# EAGLE design driver (EAGLE 9.5.0)
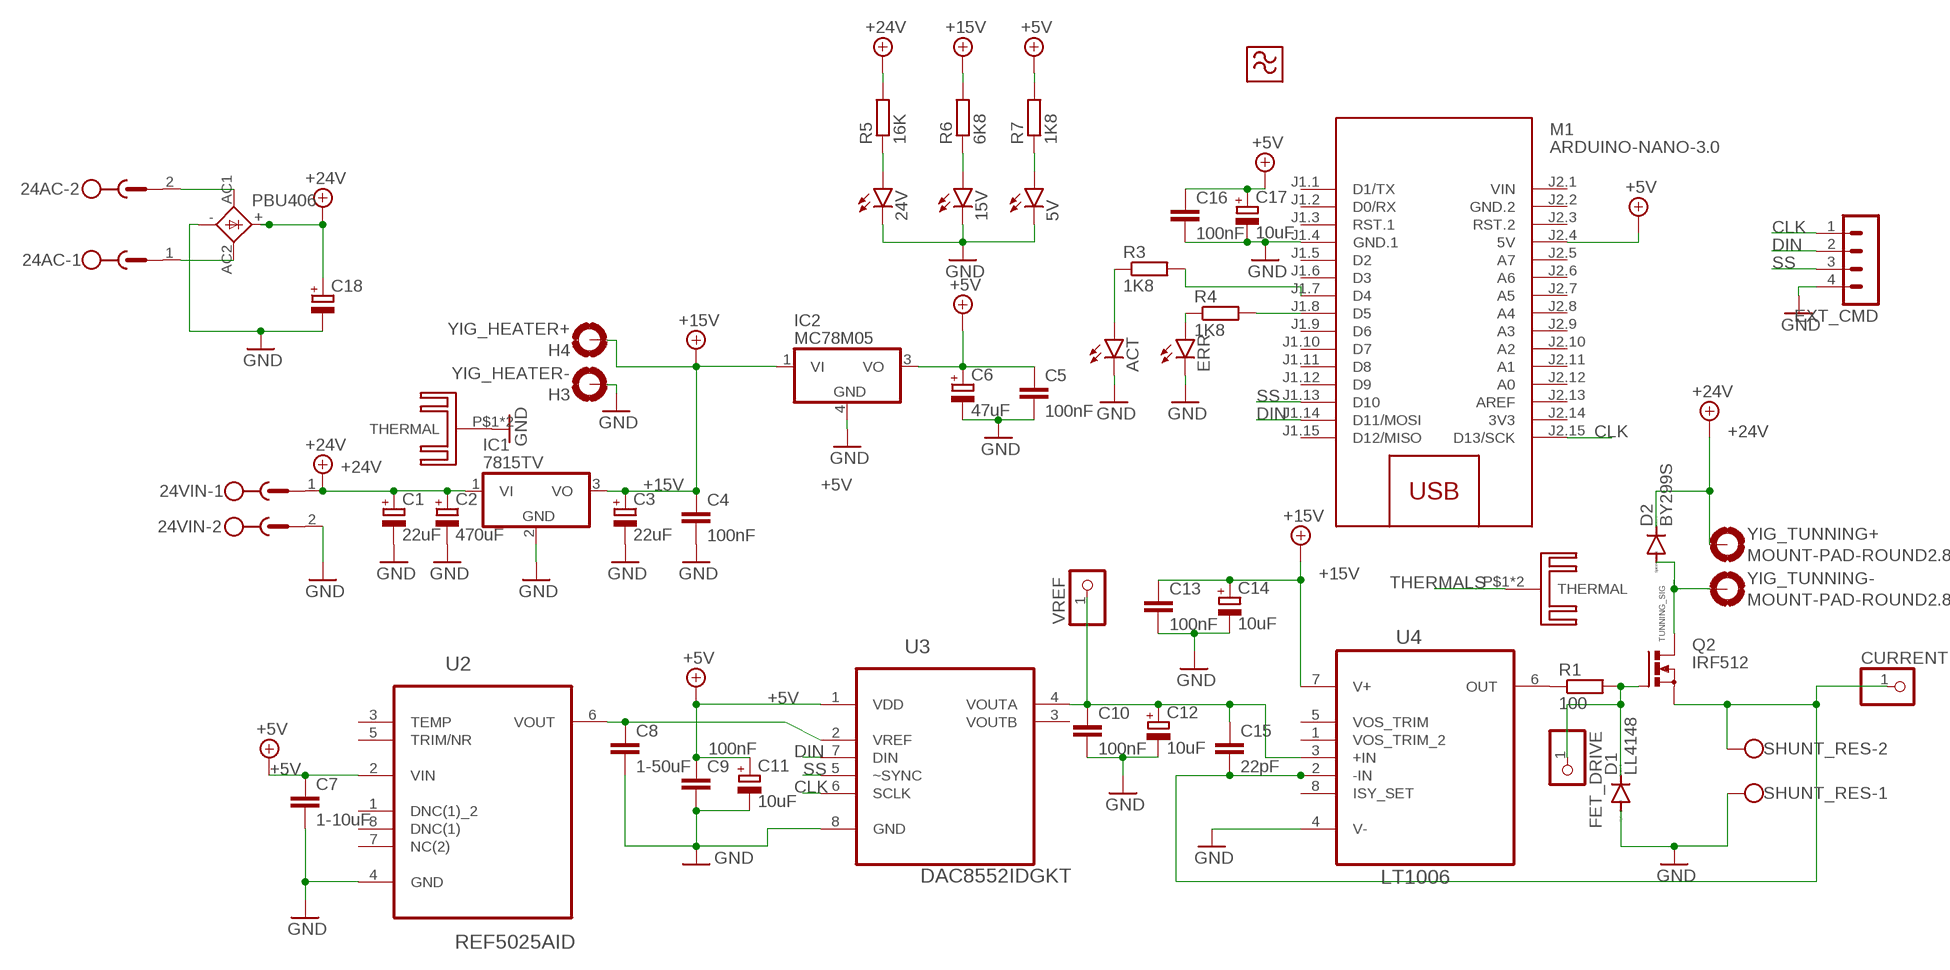
[diagram p0: schematic, sheet 1]

## Parts
5V  LEDCHIP-LED0805  [CHIP-LED0805]
15V  LEDCHIP-LED0805  [CHIP-LED0805]
24AC  MSTBV2  [MSTBV2]
24V  LEDCHIP-LED0805  [CHIP-LED0805]
24VIN  MSTBV2  [MSTBV2]
ACT  LEDCHIP-LED0805  [CHIP-LED0805]
C1  22uF  CPOL-EUE  [PANASONIC_E]
C2  470uF  CPOL-EUE5-10.5  [E5-10,5]
C3  22uF  CPOL-EUE  [PANASONIC_E]
C4  100nF  C-EUC1210  [C1210]
C5  100nF  C-EUC0603K  [C0603K]
C6  47uF  CPOL-EUD  [PANASONIC_D]
C7  1-10uF  C-EUC3216  [C3216]
C8  1-50uF  C-EUC3216  [C3216]
C9  100nF  C-EUC0603K  [C0603K]
C10  100nF  C-EUC0603K  [C0603K]
C11  10uF  CPOL-EUA/3216-18R  [A/3216-18R]
C12  10uF  CPOL-EUA/3216-18R  [A/3216-18R]
C13  100nF  C-EUC1210  [C1210]
C14  10uF  CPOL-EUE2.5-5  [E2,5-5]
C15  22pF  C-EUC0603  [C0603]
C16  100nF  C-EUC0603K  [C0603K]
C17  10uF  CPOL-EUA/3216-18R  [A/3216-18R]
C18  CPOL-EUE7.5-18  [E7,5-18]
CURRENT  PINHD-1X1  [1X01]
D1  LL4148  DIODE-SOD80C  [SOD80C]
D2  BY299S  DIODE-D-10  [D-10]
ERR  LEDCHIP-LED0805  [CHIP-LED0805]
EXT_CMD  MA04-1  [MA04-1]
FET_DRIVE  PINHD-1X1  [1X01]
H3  YIG_HEATER-  MOUNT-PAD-ROUND2.8  [2,8-PAD]
H4  YIG_HEATER+  MOUNT-PAD-ROUND2.8  [2,8-PAD]
HEATSYNK  SK09/20V  [SK09/20V]
IC1  7815TV  [TO220V]
IC2  MC78M05  MC78M05CDTG  [DPACK_3]
M1  ARDUINO-NANO-3.0  [ARDUINO-NANO-3.0]
PBU406  2KBP2KBP_MINE  [2KBP_MINE]
Q2  IRF512  [TO220BV]
R1  100  R-EU_M0805  [M0805]
R3  1K8  R-EU_M0805  [M0805]
R4  1K8  R-EU_M0805  [M0805]
R5  16K  R-EU_M0805  [M0805]
R6  6K8  R-EU_M0805  [M0805]
R7  1K8  R-EU_M0805  [M0805]
SHUNT_RES  W237-102  [W237-102]
U2  REF5025AID  [SOIC127P600X175-8N]
U3  DAC8552IDGKT  [SOP65P490X110-8N]
U4  LT1006  LT1006S8PBF  [SOIC127P600X175-8N]
U$1  SK09/20V  [SK09/20V]
U$2  YIG_FILTER  [EBAY]
VREF  PINHD-1X1  [1X01]
YIG_TUNNING+  MOUNT-PAD-ROUND2.8  [2,8-PAD]
YIG_TUNNING-  MOUNT-PAD-ROUND2.8  [2,8-PAD]

## Nets
+5V: C5.1 C6.+ C7.1 C9.1 C11.+ C16.1 C17.+ IC2.3(VO) M1.J2.4(5V) R7.2 U2.2(VIN) U3.1(VDD)
+15V: C3.+ C4.1 C13.1 C14.+ H4.B2,8(MOUNT) IC1.3(VO) IC2.1(VI) R6.2 U4.7(V+)
+24V: 24VIN.1 C1.+ C2.+ C18.+ D2.C IC1.1(VI) PBU406.+ R5.2 YIG_TUNNING+.B2,8(MOUNT)
CLK: EXT_CMD.1 M1.J2.15(D13/SCK) U3.6(SCLK)
DIN: EXT_CMD.2 M1.J1.14(D11/MOSI) U3.7(DIN)
GND: 5V.C 15V.C 24V.C 24VIN.2 ACT.C C1.- C2.- C3.- C4.2 C5.2 C6.- C7.2 C8.2 C9.2 C10.2 C11.- C12.- C13.2 C14.- C16.2 C17.- C18.- D1.A ERR.C EXT_CMD.4 H3.B2,8(MOUNT) HEATSYNK.P$1(THERMAL) HEATSYNK.P$2(THERMAL) IC1.2(GND) IC2.4(GND) M1.J1.4(GND.1) PBU406.- SHUNT_RES.1 U2.4(GND) U3.8(GND) U4.4(V-)
N$1: C8.1 U2.6(VOUT) U3.2(VREF)
N$2: 24V.A R5.1
N$3: C10.1 C12.+ C15.1 U3.4(VOUTA) U4.3(+IN) VREF.1
N$4: 24AC.2 PBU406.AC1
N$5: R1.1 U4.6(OUT)
N$6: D1.C FET_DRIVE.1 Q2.G R1.2
N$7: C15.2 CURRENT.1 Q2.S SHUNT_RES.2 U4.2(-IN)
N$8: 15V.A R6.1
N$9: 5V.A R7.1
N$10: M1.J1.7(D4) R3.2
N$11: M1.J1.8(D5) R4.2
N$12: ERR.A R4.1
N$13: ACT.A R3.1
N$17: 24AC.1 PBU406.AC2
SS: EXT_CMD.3 M1.J1.13(D10) U3.5(~SYNC)
THERMALS: U$1.P$1(THERMAL) U$1.P$2(THERMAL)
TUNNING_SIG: D2.A Q2.D YIG_TUNNING-.B2,8(MOUNT)
Unconnected: M1.J1.1(D1/TX) M1.J1.2(D0/RX) M1.J1.3(RST.1) M1.J1.5(D2) M1.J1.6(D3) M1.J1.9(D6) M1.J1.10(D7) M1.J1.11(D8) M1.J1.12(D9) M1.J1.15(D12/MISO) M1.J2.3(RST.2) M1.J2.5(A7) M1.J2.6(A6) M1.J2.7(A5) M1.J2.8(A4) M1.J2.9(A3) M1.J2.10(A2) M1.J2.11(A1) M1.J2.12(A0) M1.J2.13(AREF) U2.1(DNC(1)_2) U2.3(TEMP) U2.5(TRIM/NR) U2.7(NC(2)) U2.8(DNC(1)) U3.3(VOUTB) U4.1(VOS_TRIM_2) U4.5(VOS_TRIM) U4.8(ISY_SET)

## Power pins joined to a net without a drawn wire
3V3: M1.J2.14(3V3)
GND.2: M1.J2.2(GND.2)
VIN: M1.J2.1(VIN)

## Library data of the parts
5V 15V 24V ACT ERR = led:LED: LED OSRAM: - CHIPLED LG R971, LG N971, LY N971, LG Q971, LY Q971, LO R971, LY R971 LH N974, LH R974 LS Q976, LO Q976, LY Q976 LO Q996 - Hyper CHIPLED LW Q18S LB Q993, LB Q99A, LB R99A - SideLED LS A670, LO A670, LY A670, LG A670, LP A670 LB A673, LV A673, LT A673, LW A673 LH A674 LY A675 LS A676, LA A676, LO A676, LY A676, LW A676 LS A679, LY A679, LG A679 - Hyper Micro SIDELED® LS Y876, LA Y876, LO Y876, LY Y876 LT Y87S - SmartLED LW L88C, LW L88S LB L89C, LB L89S, LG L890 LS L89K, LO L89K, LY L89K LS L896, LA L896, LO L896, LY L896 - TOPLED LS T670, LO T670, LY T670, LG T670, LP T670 LSG T670, LSP T670, LSY T670, LOP T670, LYG T670 LG T671, LOG T671, LSG T671 LB T673, LV T673, LT T673, LW T673 LH T674 LS T676, LA T676, LO T676, LY T676, LB T676, LH T676, LSB T676, LW T676 LB T67C, LV T67C, LT T67C, LS T67K, LO T67K, LY T67K, LW E67C LS E67B, LA E67B, LO E67B, LY E67B, LB E67C, LV E67C, LT E67C LW T67C LS T679, LY T679, LG T679 LS T770, LO T770, LY T770, LG T770, LP T770 LB T773, LV T773, LT T773, LW T773 LH T774 LS E675, LA E675, LY E675, LS T675 LS T776, LA T776, LO T776, LY T776, LB T776 LHGB T686 LT T68C, LB T68C - Hyper Mini TOPLED® LB M676 - Mini TOPLED Santana® LG M470 LS M47K, LO M47K, LY M47K Source: http://www.osram.convergy.de LUXEON: - LUMILED® LXK2-PW12-R00, LXK2-PW12-S00, LXK2-PW14-U00, LXK2-PW14-V00 LXK2-PM12-R00, LXK2-PM12-S00, LXK2-PM14-U00 LXK2-PE12-Q00, LXK2-PE12-R00, LXK2-PE12-S00, LXK2-PE14-T00, LXK2-PE14-U00 LXK2-PB12-K00, LXK2-PB12-L00, LXK2-PB12-M00, LXK2-PB14-N00, LXK2-PB14-P00, LXK2-PB14-Q00 LXK2-PR12-L00, LXK2-PR12-M00, LXK2-PR14-Q00, LXK2-PR14-R00 LXK2-PD12-Q00, LXK2-PD12-R00, LXK2-PD12-S00 LXK2-PH12-R00, LXK2-PH12-S00 LXK2-PL12-P00, LXK2-PL12-Q00, LXK2-PL12-R00 Source: www.luxeon.com KINGBRIGHT: KA-3528ASYC Source: www.kingbright.com
24AC 24VIN = con-phoenix-500:MSTBV2: PHOENIX; OC_FARNELL: unknown; OC_NEWARK: unknown
C1-C3 C6 C11 C12 C14 C17 C18 = rcl:CPOL-EU: POLARIZED CAPACITOR, European symbol; SPICEPREFIX: C
C4 C5 C7-C10 C13 C15 C16 = rcl:C-EU: CAPACITOR, European symbol; SPICEPREFIX: C
CURRENT FET_DRIVE VREF = pinhead:PINHD-1X1: PIN HEADER
D1 D2 = diode:DIODE-: DIODE
EXT_CMD = con-lstb:MA04-1: PIN HEADER; OC_FARNELL: unknown; OC_NEWARK: unknown
H3 H4 YIG_TUNNING+ YIG_TUNNING- = holes:MOUNT-PAD-ROUND: MOUNTING PAD, round
HEATSYNK U$1 = heatsink:SK09/20V
IC1 = linear:78*: Positive VOLTAGE REGULATOR Source: http://cache.national.com/ds/LM/LM78L05.pdf http://www.fairchildsemi.com/ds/LM/LM7805.pdf
IC2 = linear:MC78M: 500 mA Positive Voltage Regulators Source: Data sheet <http://www.onsemi.com/pub_link/Collateral/MC78M00-D.PDF>
M1 = diy-modules:ARDUINO-NANO-3.0: Arduino Nano 3.0 and compatible devices More details available here: https://www.arduino.cc/en/Main/ArduinoBoardNano Click here to find device on ebay.com <http://www.ebay.com/sch/arduino+nano>
PBU406 = rectifier_mine:2KBP: RECTIFIER grid 3 x 3,81 mm
Q2 = transistor-power:IRF512: N-CHANNEL MOS FET
R1 = rcl:R-EU_: RESISTOR, European symbol; SPICEPREFIX: R
R3-R7 = resistor:R-EU_: RESISTOR, European symbol
SHUNT_RES = con-wago-500:W237-102: WAGO SCREW CLAMP; MPN: 237-102; OC_FARNELL: unknown; OC_NEWARK: 70K9898
U2 = Texas Instruments_By_element14_Batch_1:REF5025AID: Low-Noise, Very Low Drift, Precision VOLTAGE REFERENCE; MPN: REF5025AID; OC_FARNELL: 1439622; OC_NEWARK: 50M8895; PACKAGE: SOIC-8; SUPPLIER: Texas Instruments
U3 = Texas Instruments_By_element14_Batch_1:DAC8552IDGKT: 0.05ìV/°C max, SINGLE-SUPPLY CMOS OPERATIONAL AMPLIFIERS Zer.-Drift Series; MPN: DAC8552IDGKT; OC_FARNELL: -; OC_NEWARK: 06M7244; PACKAGE: MSOP-8; SUPPLIER: Texas Instruments
U4 = LTC_By_element14_Batch_1:LT1006S8PBF: Precision, Single Supply Op Amp; MPN: LT1006S8#PBF; OC_FARNELL: 9559230; OC_NEWARK: 57M0724; PACKAGE: SOIC-8; SUPPLIER: Linear Technology
U$2 = yig:YIG_FILTER

## Board
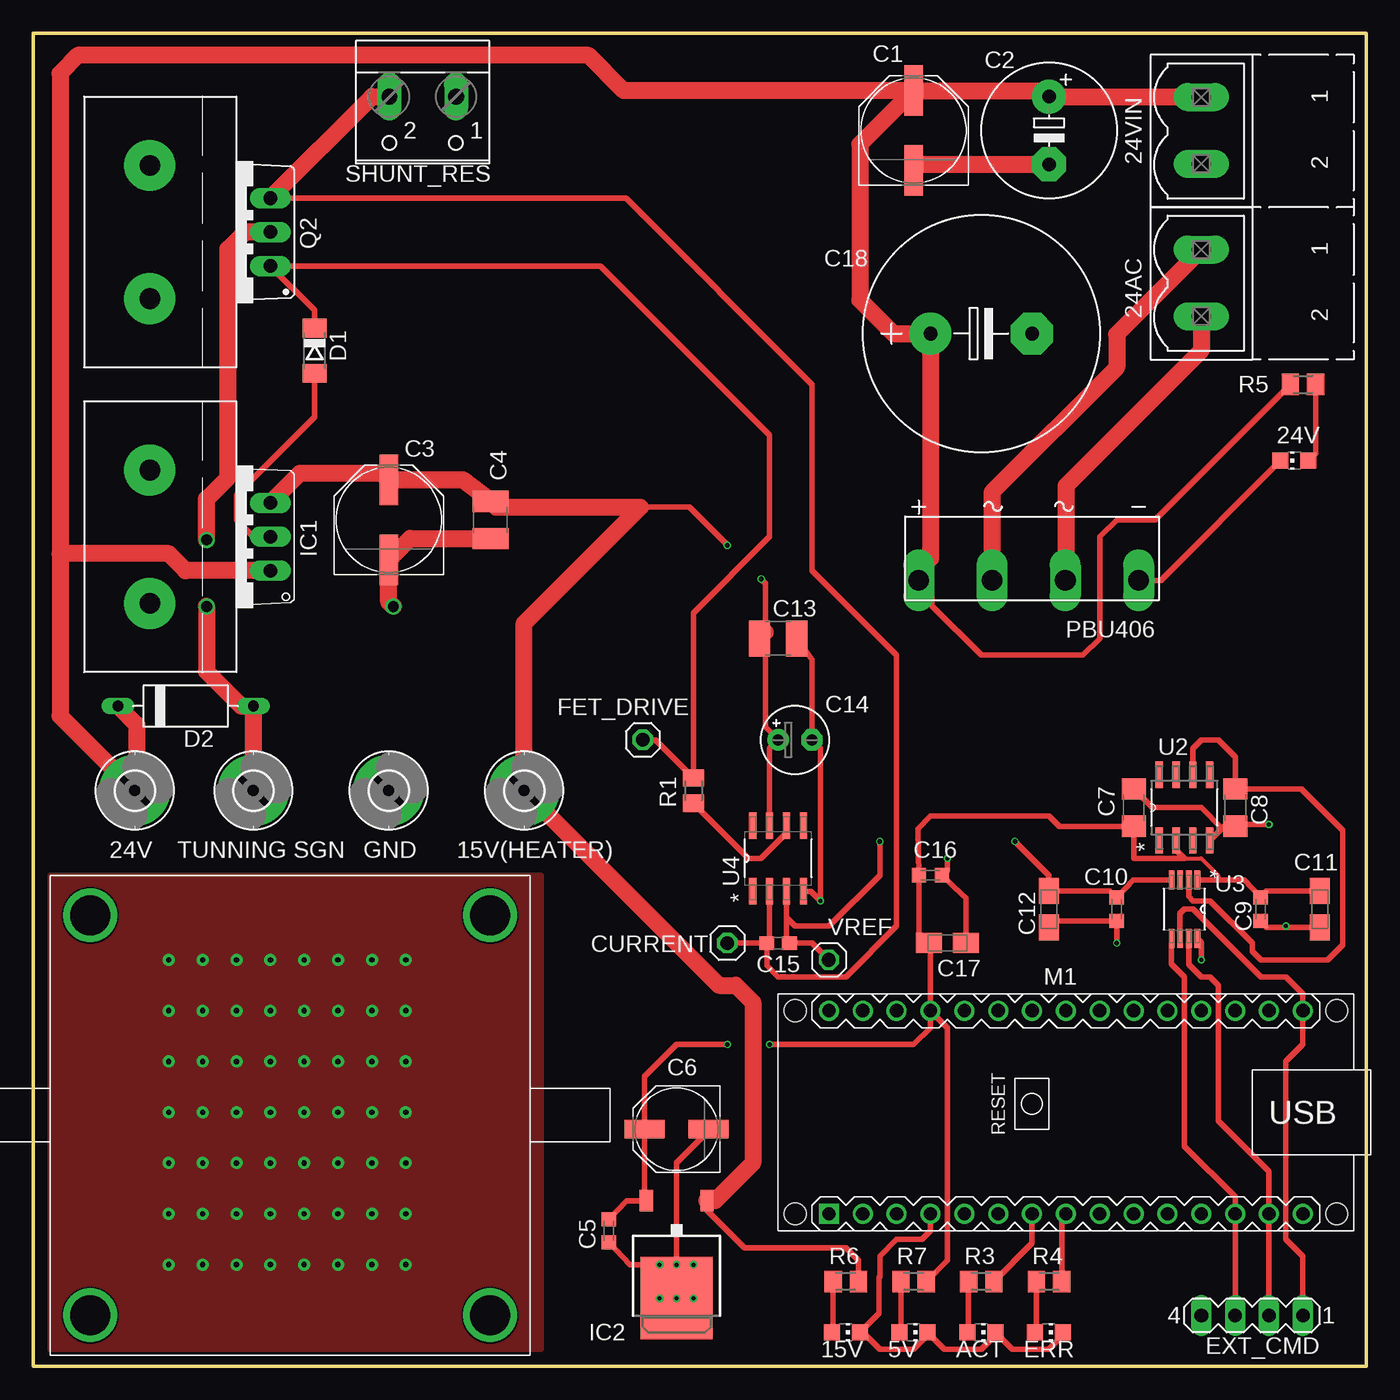
[diagram p1: board, top side]
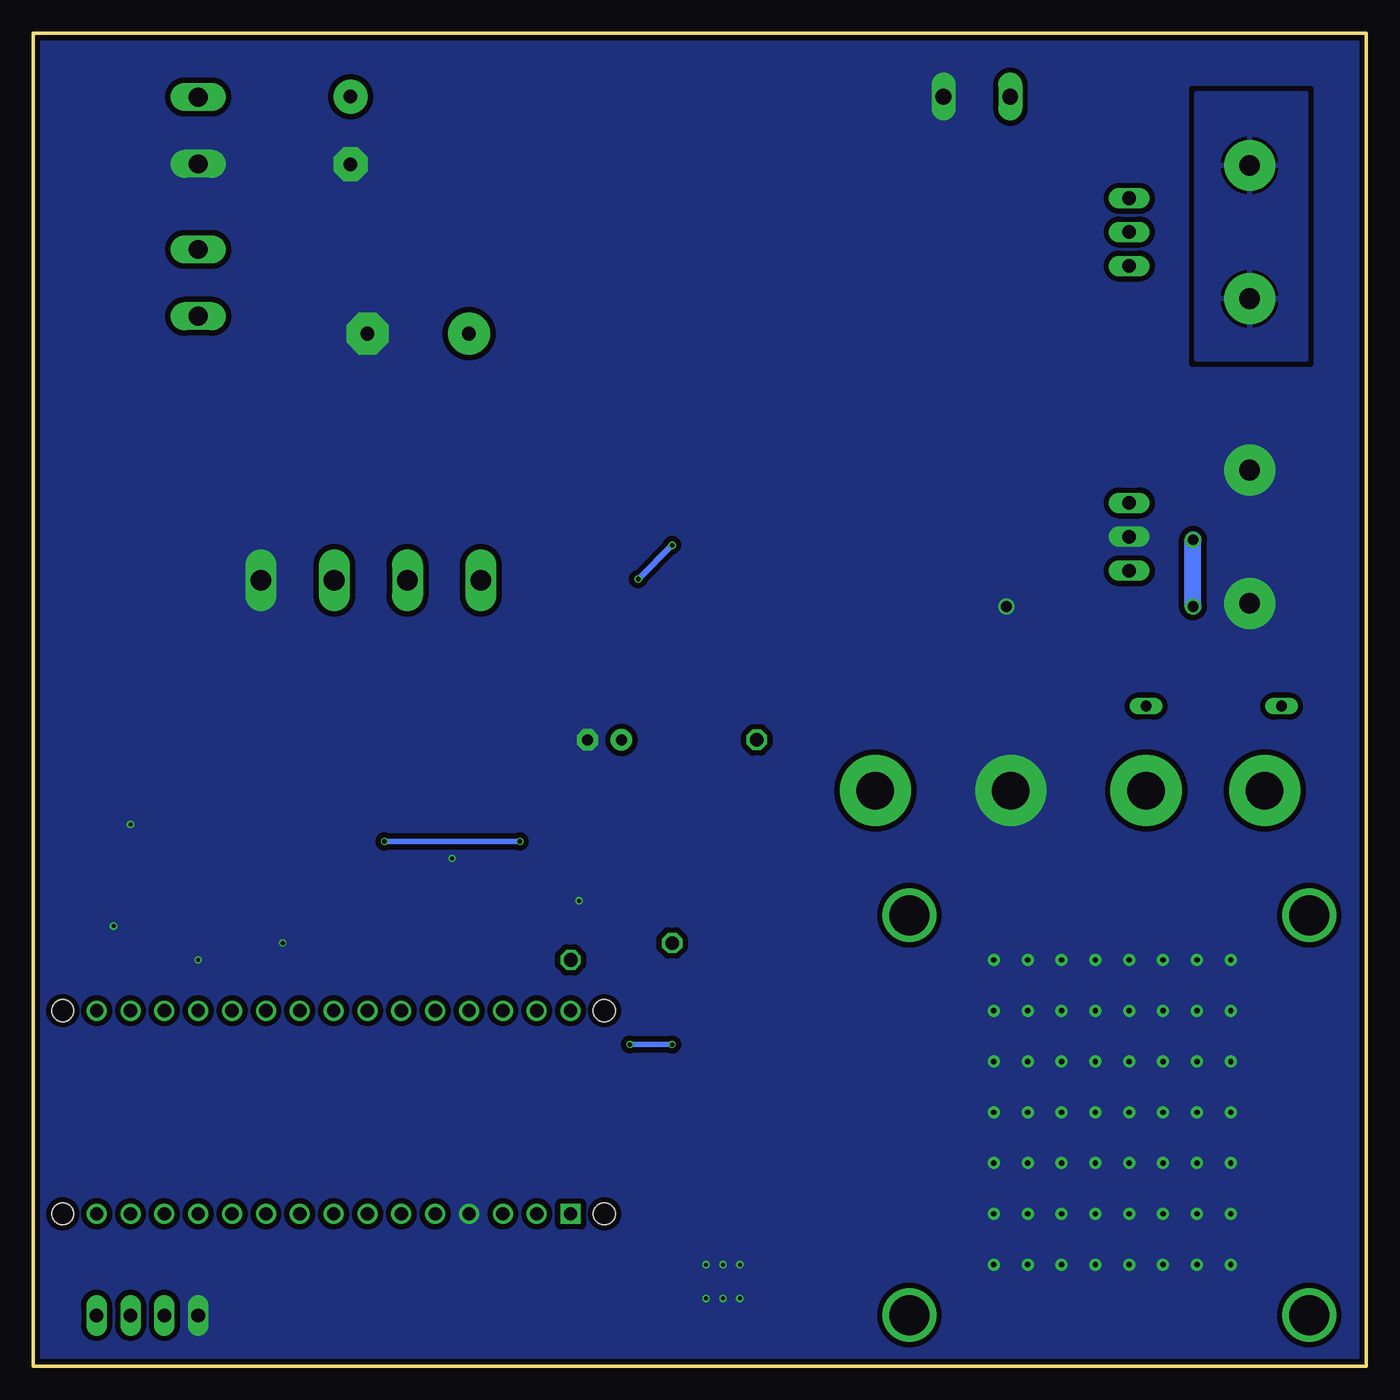
[diagram p2: board, bottom side, seen from below]

Size 100 x 100 mm. Coordinates in mm from the lower left corner, seen from the top.
Outline: 0,0 100,0 100,100 0,100 0,0
Copper layers (1*16): Top 0.035559375mm / dielectric 1.6mm / Bottom 0.035559375mm
Design rules "jlcpcb2layer": minimum track width 5mil, minimum drill 8mil, track to track 5mil, track to pad 5mil, pad to pad 5mil, via to via 5mil, smd to smd 5mil, copper to edge 8mil, drill to drill 6mil, minimum pad ring 5mil, minimum via ring 3mil, stop-mask expansion 2.5mil, vias tented up to drill 0mil, thermal gap 10mil

### Footprints (pad centres in the part's own frame; a part is rotated, then mirrored left to right if it is on the bottom)
CHIP-LED0805 = smd 1.2 x 1.2: A 0,-1.05; C 0,1.05
MSTBV2 = drill 1.397 long: 1 -2.5,0; 2 2.5,0
PANASONIC_E = smd 3.8 x 1.4: + 3,0; - -3,0
E5-10,5 = drill 1.016 pad 2.54: + -2.54,0 | drill 1.016 pad 2.54 octagon: - 2.54,0
C1210 = smd 1.6 x 2.7: 1 -1.4,0; 2 1.4,0
C0603K = smd 1.05 x 1.08: 1 -0.875,0; 2 0.875,0
PANASONIC_D = smd 3 x 1.4: + 2.4,0; - -2.4,0
C3216 = smd 1.6 x 1.8: 1 -1.4,0; 2 1.4,0
A/3216-18R = smd 1.95 x 1.5: + 1.375,0; - -1.375,0
E2,5-5 = drill 0.813 pad 1.6: + -1.27,0 | drill 0.813 pad 1.6 octagon: - 1.27,0
C0603 = smd 1.1 x 1: 1 -0.85,0; 2 0.85,0
E7,5-18 = drill 1.016 pad 3.15: + -3.81,0 | drill 1.016 pad 3.15 octagon: - 3.81,0
1X01 = drill 1.016 octagon: 1 0,0
SOD80C = smd 1.4 x 1.8: A 1.7,0; C -1.7,0
D-10 = drill 0.813 long: A 5.08,0; C -5.08,0
MA04-1 = drill 1.016 long: 1 -3.81,0; 2 -1.27,0; 3 1.27,0; 4 3.81,0
2,8-PAD = drill 2.8 pad 5.334: B2,8 0,0
SK09/20V = drill 1.55 pad 3.81: P$1 -5,6.5; P$2 5,6.5
TO220V = drill 1.016 long: 1 -2.54,-2.54; 2 0,-2.54; 3 2.54,-2.54
DPACK_3 = smd 1 x 1.6: 1 -2.28,-4.8; 3 2.28,-4.8 | smd 5.4 x 6.2: 4 0,2.5
ARDUINO-NANO-3.0 = drill 1 square: J1.1 17.78,7.62 | drill 1: J1.2 15.24,7.62; J1.3 12.7,7.62; J1.4 10.16,7.62; J1.5 7.62,7.62; J1.6 5.08,7.62; J1.7 2.54,7.62; J1.8 0,7.62; J1.9 -2.54,7.62; J1.10 -5.08,7.62; J1.11 -7.62,7.62; J1.12 -10.16,7.62; J1.13 -12.7,7.62; J1.14 -15.24,7.62; J1.15 -17.78,7.62; J2.1 17.78,-7.62; J2.2 15.24,-7.62; J2.3 12.7,-7.62; J2.4 10.16,-7.62; J2.5 7.62,-7.62; J2.6 5.08,-7.62; J2.7 2.54,-7.62; J2.8 0,-7.62; J2.9 -2.54,-7.62; J2.10 -5.08,-7.62; J2.11 -7.62,-7.62; J2.12 -10.16,-7.62; J2.13 -12.7,-7.62; J2.14 -15.24,-7.62; J2.15 -17.78,-7.62 | hole 1.651: -20.32,7.62; -20.32,-7.62; 20.32,-7.62; 20.32,7.62
2KBP_MINE = drill 1.55 long: + 8.5,2; - -8,2; AC1 -2.5,2; AC2 3,2
TO220BV = drill 1.016 long: D 0,-2.54; G -2.54,-2.54; S 2.54,-2.54
M0805 = smd 1.3 x 1.6: 1 -0.95,0; 2 0.95,0
W237-102 = drill 1.194 long: 1 -2.5,-1.27; 2 2.5,-1.27
SOIC127P600X175-8N = smd 1.981 x 0.559: 1 -2.464,1.905; 2 -2.464,0.635; 3 -2.464,-0.635; 4 -2.464,-1.905; 5 2.464,-1.905; 6 2.464,-0.635; 7 2.464,0.635; 8 2.464,1.905
SOP65P490X110-8N = smd 1.422 x 0.432: 1 -2.184,0.965; 2 -2.184,0.33; 3 -2.184,-0.33; 4 -2.184,-0.965; 5 2.184,-0.965; 6 2.184,-0.33; 7 2.184,0.33; 8 2.184,0.965
SOIC127P600X175-8N' = smd 1.981 x 0.533: 1 -2.464,1.905; 2 -2.464,0.635; 3 -2.464,-0.635; 4 -2.464,-1.905; 5 2.464,-1.905; 6 2.464,-0.635; 7 2.464,0.635; 8 2.464,1.905
EBAY = drill 3: P$1 3,-3; P$2 33,-3; P$3 3,-33; P$4 33,-33

### Placement (x,y rotation side)
5V  66.04,2.54 270 top
15V  60.96,2.54 270 top
24AC  87.63,81.28 270 top
24V  94.61,67.94 90 top
24VIN  87.63,92.71 270 top
ACT  71.12,2.54 270 top
C1  66.04,92.71 90 top
C2  76.2,92.71 270 top
C3  26.67,63.5 90 top
C4  34.29,63.5 270 top
C5  43.18,10.16 270 top
C6  48.26,17.78 180 top
C7  82.55,41.91 90 top
C8  90.17,41.91 270 top
C9  92.08,34.29 270 top
C10  81.28,34.29 270 top
C11  96.52,34.29 90 top
C12  76.2,34.29 90 top
C13  55.88,54.61 0 top
C14  57.15,46.99 0 top
C15  55.88,31.75 180 top
C16  67.31,36.83 0 top
C17  68.58,31.75 180 top
C18  71.12,77.47 0 top
CURRENT  52.07,31.75 0 top
D1  21.09,76.18 270 top
D2  11.43,49.53 0 top
ERR  76.2,2.54 270 top
EXT_CMD  91.44,3.81 180 top
FET_DRIVE  45.72,46.99 0 top
H3  26.67,43.18 0 top
H4  36.83,43.18 0 top
HEATSYNK  15.24,62.23 90 top
IC1  15.24,62.23 90 top
IC2  48.26,7.62 180 top
M1  77.47,19.05 180 top
PBU406  74.93,60.96 180 top
Q2  15.24,85.09 90 top
R1  49.53,43.18 90 top
R3  71.12,6.35 0 top
R4  76.2,6.35 0 top
R5  95.25,73.66 180 top
R6  60.96,6.35 0 top
R7  66.04,6.35 0 top
SHUNT_RES  29.21,93.98 180 top
U2  86.36,41.91 90 top
U3  86.36,34.29 270 top
U4  LT1006  [SOIC127P600X175-8N']  55.88,38.1 90 top
U$1  15.24,85.09 90 top
U$2  1.27,36.83 0 top
VREF  59.69,30.48 0 top
YIG_TUNNING+  7.62,43.18 0 top
YIG_TUNNING-  16.51,43.18 0 top

### Tracks (layer width: path | path; a pad name or v marks a point on that pad's centre or on a via)
+5V  (via drill 0.35)
  Top 0.305: 86.36,38.1 87.63,38.1 88.9,36.83 88.9,36.47
  Top 0.406: C5.1 44.49,12.42 IC2.3 45.86,12.54 C6.+ 45.86,21.73 48.26,24.13 v52.07,24.13 | M1.J2.4 68.58,25.4 68.58,7.94 R7.2 | M1.J2.4 67.31,25.4 66.04,24.13 v55.24,24.13 | U3.1 88.9,36.47 90.84,36.47 C9.1 92.5,35.66 C11.+ | U2.2 85.72,38.73 86.36,38.1 82.55,38.1 C7.1 76.97,40.51 76.2,41.27 67.31,41.27 66.36,40.33 C16.1 66.44,32.52 C17.+ 67.31,31.64 M1.J2.4
  Bottom 0.406: v55.24,24.13 v52.07,24.13
+15V  (via drill 0.35 pad 0.55)
  Top 0.406: R6.2 61.91,7.94 60.96,8.89 53.34,8.89 50.54,11.69 IC2.1 | 45.55,64.45 49.22,64.45 v52.07,61.59 | v54.61,59.05 54.93,58.73 54.93,55.07 | U4.7 55.24,46.35 C14.+ 54.93,47.94 54.93,54.16 C13.1
  Top 1.27: IC1.3 20.01,67 26.17,67 C3.+ 32.24,66.5 C4.1 34.74,64.45 45.55,64.45 36.83,55.73 H4.B2,8 51.44,28.57 52.7,28.57 53.98,27.3 53.98,15.24 51.16,12.42 IC2.1 | 54.93,55.07 C13.1
  Bottom 0.406: v52.07,61.59 v54.61,59.05
+24V
  Top 0.406: R5.2 84.14,63.5 81.28,63.5 80.01,62.23 80.01,54.61 78.74,53.34 71.12,53.34 67.43,57.03 67.43,57.96 66.5,58.88
  Top 1.27: C1.+ 62,91.67 62,80 64.53,77.47 C18.+ 67.31,60.62 66.04,59.35 PBU406.+ 66.5,58.88 | C1.+ 44.29,95.71 41.65,98.35 3.35,98.35 2,97 2,60.96 | 24VIN.1 87.63,95.25 C2.+ 75.74,95.71 C1.+ | 2,60.96 2,48.8 YIG_TUNNING+.B2,8 7.77,43.33 7.77,48.11 D2.C | IC1.1 11.43,59.69 10.16,60.96 2,60.96
CLK
  Top 0.406: U3.6 86.03,33.96 86.36,34.29 87,34.29 92.08,29.21 93.98,29.21 95.25,27.94 M1.J2.15 95.25,24.13 93.98,22.86 93.98,9.53 95.25,8.26 EXT_CMD.1
DIN
  Top 0.406: U3.7 86.69,30.15 87.63,29.21 88.27,29.21 88.9,28.57 88.9,18.41 92.71,14.61 M1.J1.14 EXT_CMD.2
GND  (via drill 0.3 pad 0.55, 0.35, 0.4 pad 0.9, 0.8)
  Top 0.406: ERR.C 77.25,2.32 76.2,1.27 73.44,1.27 ACT.C 72.17,2.32 71.12,1.27 68.36,1.27 5V.C 67.09,2.32 66.04,1.27 63.5,1.27 62.23,2.54 15V.C 63.45,3.98 63.45,6.66 63.5,6.71 63.5,8.26 64.77,9.53 66.67,9.53 67.31,10.16 M1.J1.4 | C5.2 44.77,7.62 v46.99,7.62 | C6.- 50.66,17.64 48.26,15.24 v48.26,7.62 | U4.4 58.34,35.64 v59.05,34.92 59.05,46.35 C14.- 58.42,53.02 C13.2 | v68.58,38.1 68.58,37.15 C16.2 69.69,35.39 69.95,35.12 C17.- | 89.18,40.36 89.33,40.51 C8.2 90.3,40.64 v92.71,40.64 | 89.18,40.36 U2.4 | C7.2 83.95,41.91 87.63,41.91 89.18,40.36 | C9.2 92.5,32.91 C11.- 94.08,32.91 v93.98,33.02 | U3.8 87.63,31.8 v87.63,30.48 | v81.28,31.75 C10.2 76.7,33.41 C12.- | IC2.4 v48.26,5.08 | PBU406.- 84.58,58.96 24V.C | IC1.2 16.51,62.23 15.24,63.5 15.24,65.36 21.09,71.21 D1.A
  Top 1.27: C1.- 66.5,90.17 C2.- | C4.2 28.27,62.1 C3.- 26.67,57.33 v27,57
  other vias: 49.53,7.62 46.99,5.08 49.53,5.08 10.16,30.48 12.7,30.48 15.24,30.48 17.78,30.48 20.32,30.48 22.86,30.48 25.4,30.48 27.94,30.48 10.16,22.86 12.7,22.86 15.24,22.86 17.78,22.86 20.32,22.86 22.86,22.86 25.4,22.86 27.94,22.86 10.16,26.67 12.7,26.67 15.24,26.67 17.78,26.67 20.32,26.67 22.86,26.67 25.4,26.67 27.94,26.67 10.16,19.05 12.7,19.05 15.24,19.05 17.78,19.05 20.32,19.05 22.86,19.05 25.4,19.05 27.94,19.05 10.16,15.24 12.7,15.24 15.24,15.24 17.78,15.24 20.32,15.24 22.86,15.24 25.4,15.24 27.94,15.24 10.16,11.43 12.7,11.43 15.24,11.43 17.78,11.43 20.32,11.43 22.86,11.43 25.4,11.43 27.94,11.43 10.16,7.62 12.7,7.62 15.24,7.62 17.78,7.62 20.32,7.62 22.86,7.62 25.4,7.62 27.94,7.62
  pour Bottom (isolate 0.406, rank 2, no thermals): 0,100 100,100 100,0 0,0
  pour Top: 1.27,36.83 38.1,36.83 38.1,1.27 1.27,1.27
N$1
  Top 0.406: U2.6 87,46.35 87.63,46.99 88.9,46.99 90.17,45.72 C8.1 95.12,43.31 98.25,40.19 98.25,31.62 97.11,30.48 92.08,30.48 91.44,31.11 91.44,31.75 88.27,34.92 87,34.92 86.69,35.23 U3.2
N$2
  Top 0.406: R5.1 96.2,68.48 24V.A
N$3  (via drill 0.35)
  Top 0.406: v63.5,39.37 63.5,36.83 59.69,33.02 57.15,33.02 56.52,33.66 U4.3 56.52,31.96 C15.1 58.42,31.75 VREF.1 | v73.66,39.37 76.2,36.83 C12.+ 80.78,35.66 C10.1 82.51,36.47 U3.4
  Bottom 0.406: v63.5,39.37 v73.66,39.37
N$4
  Top 1.27: 24AC.2 87.63,76.2 77.47,66.04 77.47,59 PBU406.AC1
N$5
  Top 0.406: R1.1 53.66,38.1 54.61,38.1 56.52,40.01 U4.6
N$6
  Top 0.406: FET_DRIVE.1 46.67,46.99 R1.2 49.53,56.52 55.24,62.23 55.24,69.85 42.55,82.55 Q2.G 21.09,79.24 D1.C
N$7
  Top 0.406: U4.2 55.24,31.96 C15.2 | Q2.S 44.45,87.63 58.42,73.66 58.42,59.69 64.77,53.34 64.77,33.02 60.96,29.21 55.88,29.21 55.03,30.06 C15.2 | CURRENT.1 C15.2
  Top 1.27: Q2.S 25.4,95.25 SHUNT_RES.2
N$8
  Top 0.406: R6.1 60.01,2.64 15V.A
N$9
  Top 0.406: R7.1 65.09,2.64 5V.A
N$10
  Top 0.406: R3.2 74.93,9.21 M1.J1.7
N$11
  Top 0.406: R4.2 77.15,11.11 M1.J1.8
N$12
  Top 0.406: R4.1 75.25,2.64 ERR.A
N$13
  Top 0.406: R3.1 70.17,2.64 ACT.A
N$17
  Top 1.27: 24AC.1 81.28,77.43 81.28,74.93 71.93,65.58 PBU406.AC2
SS
  Top 0.406: U3.5 85.39,30.18 86.36,29.21 86.36,16.51 90.17,12.7 M1.J1.13 EXT_CMD.3
THERMALS
  pour Bottom: 4.54,95.47 12.7,95.47 12.7,75.54 4.54,75.54
TUNNING_SIG  (via drill 0.8)
  Top 1.27: v13,62 13,65.07 14.61,66.67 14.61,83.82 15.88,85.09 Q2.D | v13,57 13,52.13 15.6,49.53 D2.A YIG_TUNNING-.B2,8
  Bottom 1.27: v13,57 v13,62

### Text on the board
tNames: 24V | TUNNING SGN | GND | 15V(HEATER)
tValues: + | - | - | GND | SS | DIN | CLK